# Altium schematic sheet REF_TIMING.SchDoc
size A4; SheetNumber: 6; SheetTotal: 7
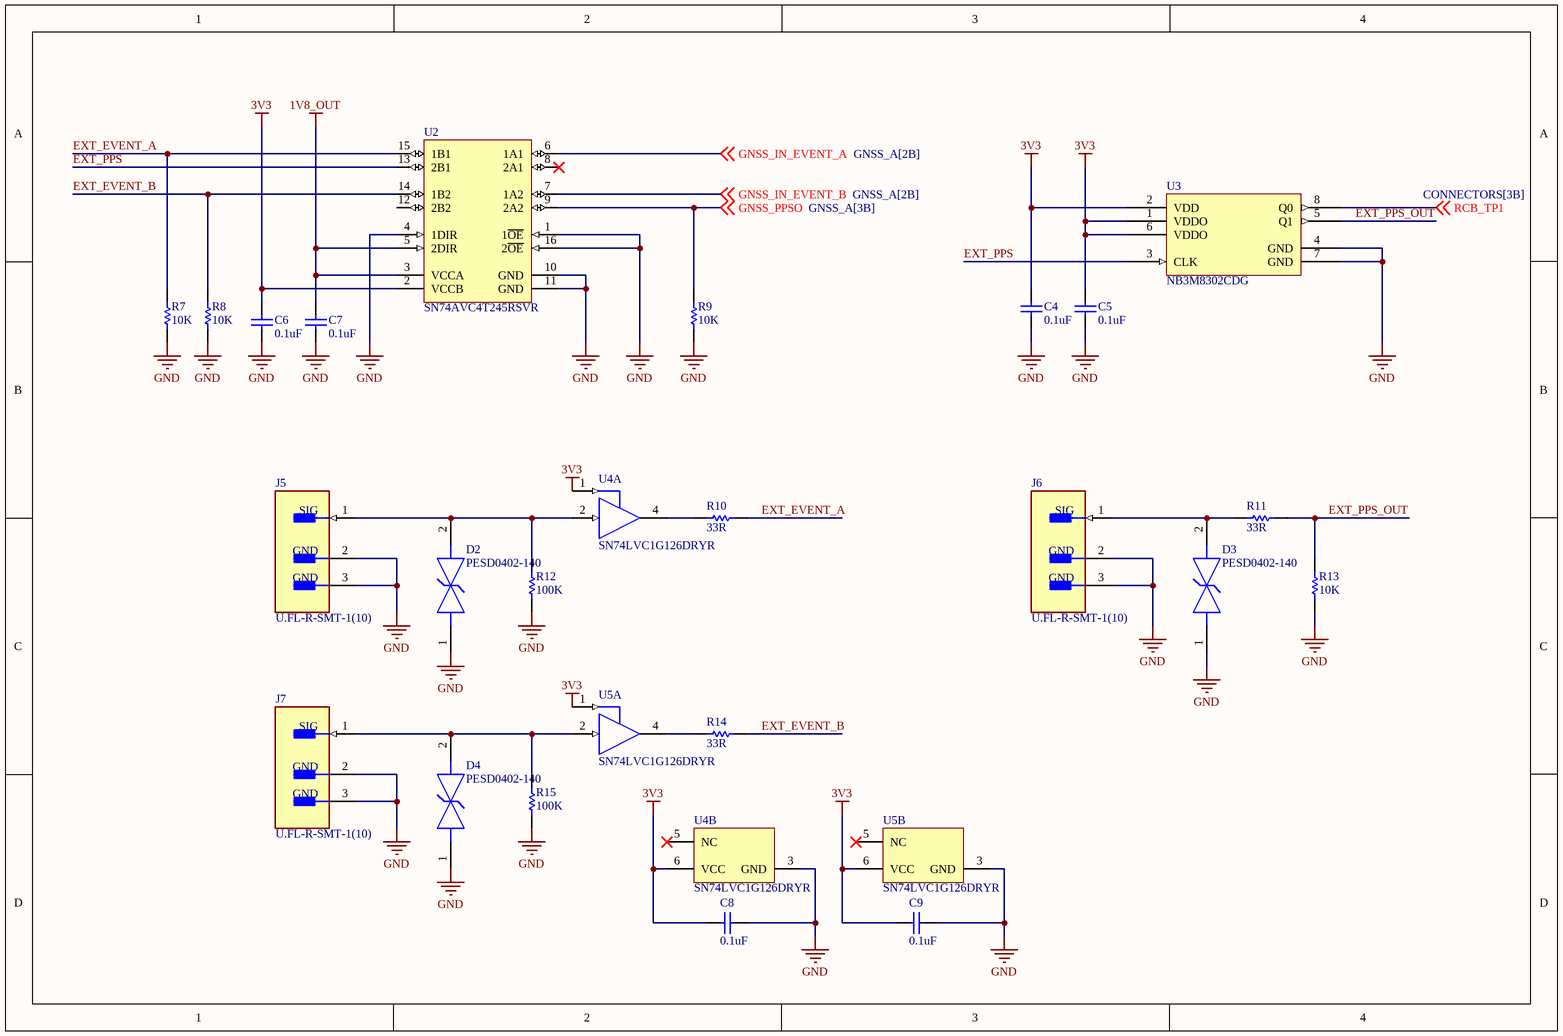
[diagram p0: REF_TIMING.SchDoc]

## Parts
C4  0.1uF  [CAPC1005X56X25LL10T15]
C5  0.1uF  [CAPC1005X56X25LL10T15]
C6  0.1uF  [CAPC1005X56X25LL10T15]
C7  0.1uF  [CAPC1005X56X25LL10T15]
C8  0.1uF  [CAPC1005X56X25LL10T15]
C9  0.1uF  [CAPC1005X56X25LL10T15]
D2  PESD0402-140  [FP-PESD0402-MFG]
D3  PESD0402-140  [FP-PESD0402-MFG]
D4  PESD0402-140  [FP-PESD0402-MFG]
J5  U.FL-R-SMT-1(10)  [FP-U_FL-R-SMT-1_10-MFG]
J6  U.FL-R-SMT-1(10)  [FP-U_FL-R-SMT-1_10-MFG]
J7  U.FL-R-SMT-1(10)  [FP-U_FL-R-SMT-1_10-MFG]
R7  10K  [RESC1005X40X25ML05T10]
R8  10K  [RESC1005X40X25ML05T10]
R9  10K  [RESC1005X40X25ML05T10]
R10  33R  [RESC1005X40X25LL05T10]
R11  33R  [RESC1005X40X25LL05T10]
R12  100K  [RESC1005X40X25NL05T10]
R13  10K  [RESC1005X40X25ML05T10]
R14  33R  [RESC1005X40X25LL05T10]
R15  100K  [RESC1005X40X25NL05T10]
U2  SN74AVC4T245RSVR  [RSV0016A_V]
U3  NB3M8302CDG  [SOIC8_ONS]
U4  SN74LVC1G126DRYR  [DRY0006A_V]  (parts A,B of 2)
U5  SN74LVC1G126DRYR  [DRY0006A_V]  (parts A,B of 2)

## Nets
1V8_OUT: C7.2 U2.3(VCCA) U2.5(2DIR)
3V3: C4.1 C5.1 C6.2 C8.2 C9.2 U2.2(VCCB) U3.1(VDDO) U3.2(VDD) U3.6(VDDO) U4.1(OE) U4.6(VCC) U5.1(OE) U5.6(VCC)
GND: C4.2 C5.2 C6.1 C7.1 C8.1 C9.1 D2.1 D3.1 D4.1 J5.2(GND) J5.3(GND) J6.2(GND) J6.3(GND) J7.2(GND) J7.3(GND) R7.1 R8.1 R9.1 R12.1 R13.1 R15.1 U2.1(1~{OE}) U2.4(1DIR) U2.10(GND) U2.11(GND) U2.16(2~{OE}) U3.4(GND) U3.7(GND) U4.3(GND) U5.3(GND)
EXT_EVENT_A: R7.2 R10.2 U2.15(1B1)
EXT_EVENT_B: R8.2 R14.2 U2.14(1B2)
EXT_PPS: U2.13(2B1) U3.3(CLK)
EXT_PPS_OUT: R11.2 R13.2 U3.5(Q1)
GNSS_IN_EVENT_A: U2.6(1A1) ; off-sheet GNSS_IN_EVENT_A
GNSS_IN_EVENT_B: U2.7(1A2) ; off-sheet GNSS_IN_EVENT_B
GNSS_PPSO: R9.2 U2.9(2A2) ; off-sheet GNSS_PPSO
RCB_TP1: U3.8(Q0) ; off-sheet RCB_TP1
NetD2_2: D2.2 J5.1(SIG) R12.2 U4.2(A)
NetD3_2: D3.2 J6.1(SIG) R11.1
NetD4_2: D4.2 J7.1(SIG) R15.2 U5.2(A)
NetR10_1: R10.1 U4.4(Y)
NetR14_1: R14.1 U5.4(Y)

Not connected (* = marked no-connect by the designer): U2 8(2A1)* 12(2B2); U4 5(NC)*; U5 5(NC)*

## Library data of the parts
C4-C9 = CMP-2008-02743-1: Manufacturer: AVX Interconnect / Elco; Part Number: 04026D104KAT2A
D2-D4 = CMP-08607-000011-1: TVS DIODE 14V 40V 0402; Manufacturer: Littelfuse Inc.; Automotive Grade: Grade 1; Capacitance: 0.25pF; Value: 0.25pF; Direction: Bidirectional; Number Of Channels: 1; Temperature Range Low: -55°C; Lead Free: Yes; Temperature: -55°C to +125°C; Digikey Description: TVS DIODE 14V 40V 0402; Automotive: Yes; Device Class L2: TVS Diodes; Reverse Standoff Voltage: 14V; Device Class L1: Circuit Protection; Ipc Land Pattern Name: DIOC10050X33; Manufacturer Part Number: PESD0402-140; Breakdown Voltage: 14V; Height: 0.43mm; Clamping Voltage: 40V; RoHS: TRUE; Temperature Range High: +125°C; Device Class L3: unset; Octopart: https://octopart.com/pesd0402-140-littelfuse-74215061; Package: PESD0402; ComponentLink2URL: https://www.littelfuse.com/~/media/electronics/datasheets/polymer_esd_suppressors/littelfuse_polymer_esd_suppressor_pesd_catalog_datasheet.pdf.pdf; Category: Diode; ComponentLink2Description: Datasheet
J5-J7 = CMP-2000-05152-3: CONN U.FL RCPT STR 50 OHM SMD; Max Frequency: 6GHz; Connector Type: Coaxial; Body Plating: Silver; Body Material: Bronze; Impedance: 50R; Dielectric Material: Polymer; Insulation Resistance: 500MR; Gender: Male; Packaging: Cut Tape; Length: 3mm; Package Quantity: 2500; Termination: Solder; Lead Free: Lead Free; Series: U.FL; Min Operating Temperature: -40°C; Fastening Type: Snap; Contact Material: Brass; Orientation: Straight; Wire/Cable Type: Coaxial; Frequency: 6GHz; Contact Plating: Gold; Depth: 3.1mm; Weight: 0.001764oz; Max Operating Temperature: 90°C; Radiation Hardening: No; REACH SVHC: No SVHC; Mount: Surface Mount; Housing Color: Beige
R7-R9 R13 = CMP-2002-03043-1: Part Number: CRCW040210K0FKEDHP; Manufacturer: Vishay Dale
R10 R11 R14 = CMP-2002-07619-1: Part Number: RC0402FR-0733RL; Manufacturer: Yageo / Phycomp
R12 R15 = CMP-2002-07343-1: Part Number: RC0402FR-07100KL; Manufacturer: Yageo / Phycomp
U2 = CMP-2000-07132-1: Dual-Bit Bus Transceiver with Configurable Voltage Translation and 3-State Output, 1.2 to 3.6 V, -40 to 85 degC, 16-Pin UQFN (RSV), Green (RoHS & no Sb/Br), Tape and Reel; Manufacturer: Texas Instruments; Propagation Delay Time: 10.3ns; Polarity: Non-Inverting; Low Level Output Current: 12mA; High Level Output Current: -12mA; Quiescent Current: 80uA; Logic Family: AVC; Input Logic Level: CMOS; Number of  Elements: 2; Number of Channels: 4; Operating Supply Voltage (Typ): 1.8/2.5/3.3V; Operating Supply Voltage (Min): 1.2V; Operating Supply Voltage (Max): 3.6V; Technology: CMOS; Package Type: uQFN; Manufacturer URL: http://www.ti.com/; Packaging: TapeandReel; Package URL: http://www.ti.com/lit/ml/mpqf205c/mpqf205c.pdf; Pin Count: 16; Operating Temperature (Max): 85C; Mounting: SurfaceMount; Operating Temperature (Min): -40C; Operating Temperature Classification: Industrial; Package Reference: RSV0016A; Mounting Technology: SurfaceMount; Datasheet Version: Rev. G, 11/2014; Operating Temp Range: -40Cto85C; Rad Hardened: No; Datasheet URL: http://www.ti.com/lit/ds/symlink/sn74avc4t245.pdf; Output Logic Level: CMOS; Output Type: 3-State; Package Description: 16-Pin Quad Flat No-lead Package, Body 1.8 x 2.6 mm, Pitch 0.4 mm
U3 = NB3M8302CDG: No Description Available; Mfr_Name: onsemi; Copyright: Copyright (C) 2023 Ultra Librarian. All rights reserved.; Manufacturer_Part_Number: NB3M8302CDG; Digi-Key_Part_Number_1: NB3M8302CDG-ND; Digi-Key_Part_Number_2: NB3M8302CDGOS-ND; Digi-Key_Part_Number_3: 2156-NB3M8302CDG-OS-ND; RefDes: RefDes; Type: DEV
U4 U5 = CMP-0859-00836-3: Single Bus Buffer Gate With 3-State Outputs, DRY0006A, LARGE T&R; Manufacturer: Texas Instruments; Sub-Family: Non-Inverting Buffer/Driver; Bits(#): 1; Output Type: CMOS; Output Drive (IOL/IOH)(Max)(mA): 32/-32; VCC(Min)(V): 1.65; Logic: True; Voltage(Nom)(V): 1.8,2.5,3.3,5; Input Type: CMOS/TTL; 3-State Output: Yes; F @ Nom Voltage(Max)(Mhz): 150; Schmitt Trigger: No; VCC(Max)(V): 5.5; Rating: Catalog; Technology Family: LVC; ICC @ Nom Voltage(Max)(mA): 0.01; tpd @ Nom Voltage(Max)(ns): 8,5.5,4.5,4; DatasheetVersion: SCES224R; Generic Part Number: SN74LVC1G126; PackageReference: DRY0006A; Operating Temperature Range(C): -40 to 125,-40 to 85